# EAGLE design rgb-led-cc-driver-mk-4.0 (EAGLE 6.5.0)
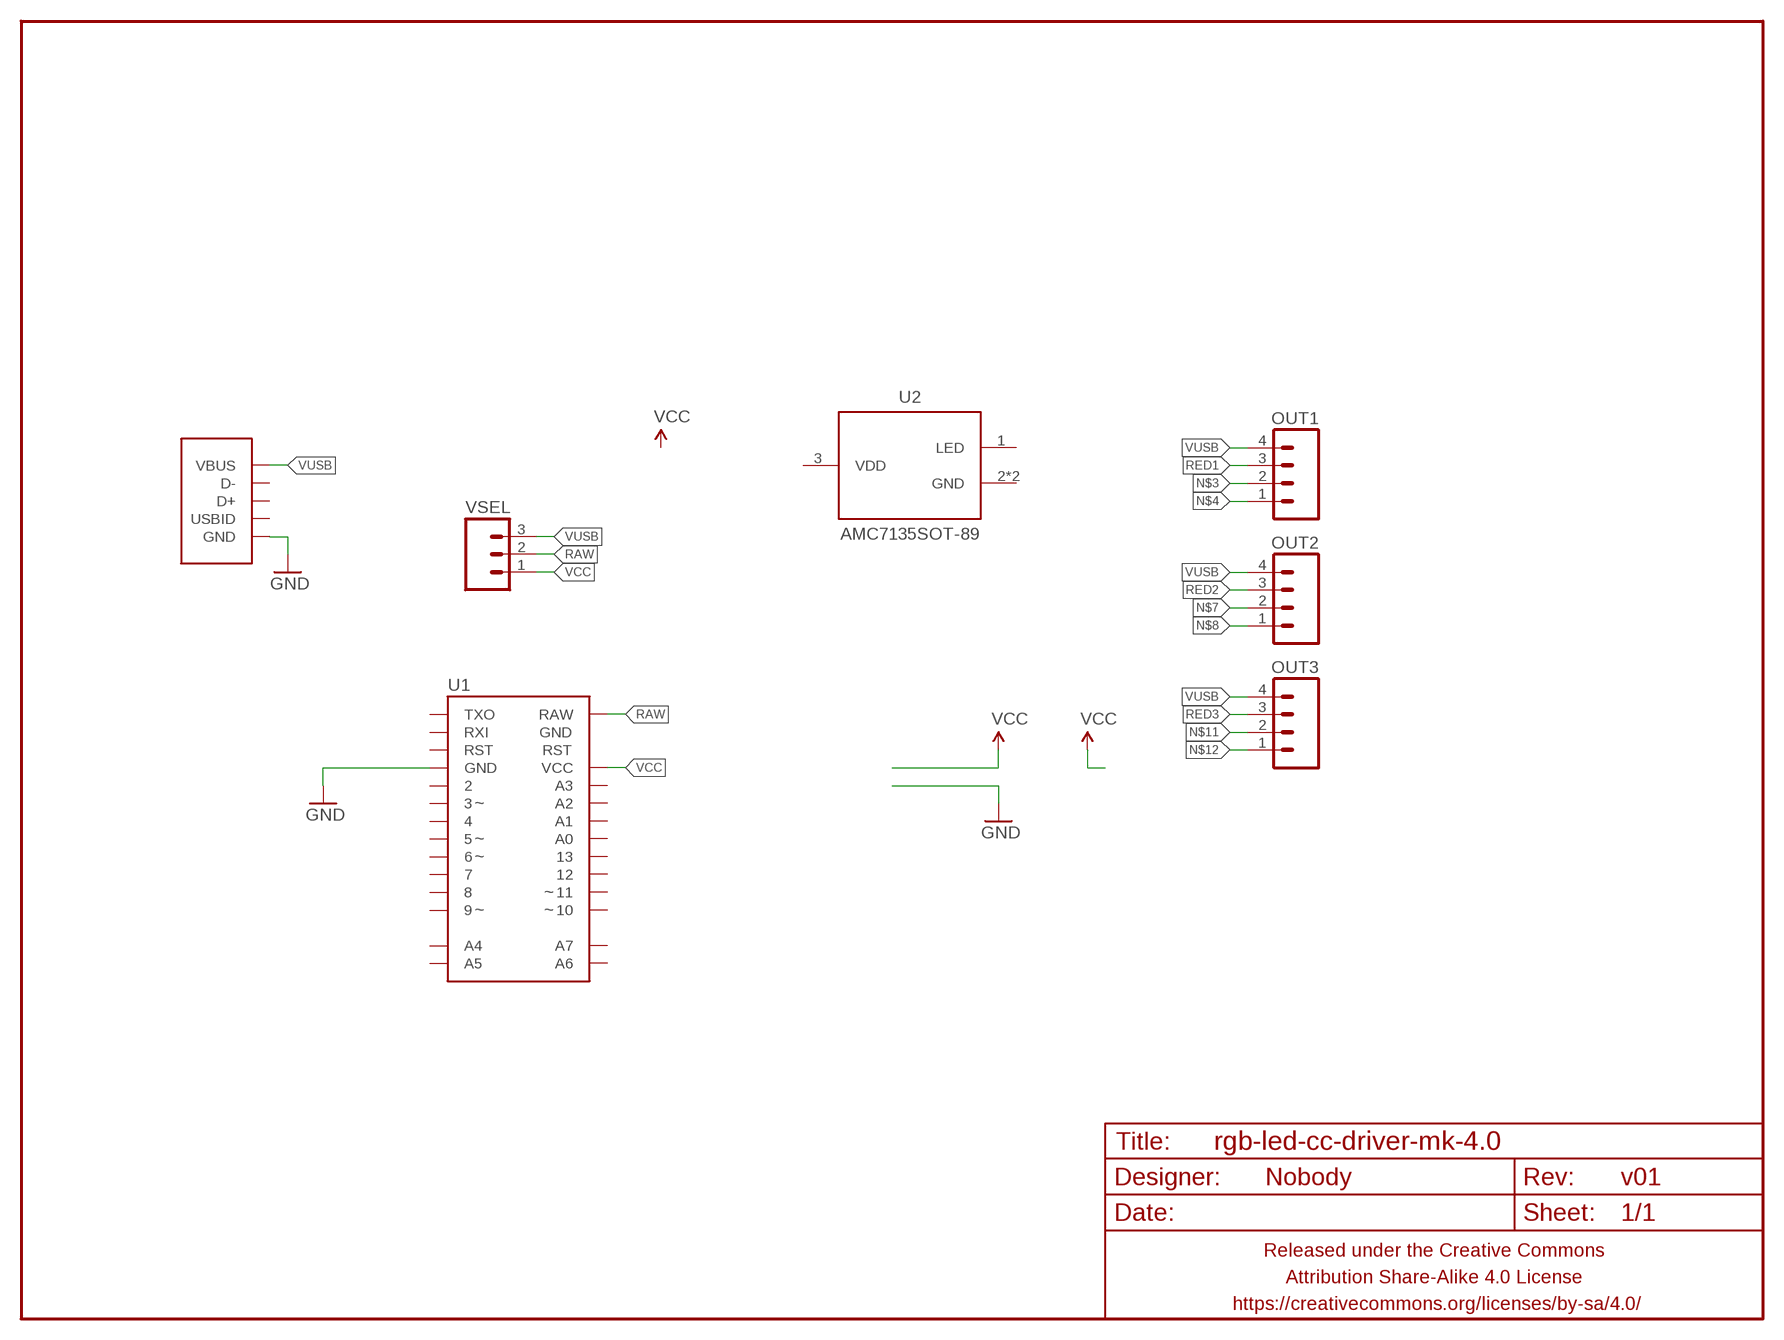
[diagram p0: schematic, sheet 1]

## Parts
FRAME1  FRAME-LETTERNO_PACKAGE  [DUMMY]
OUT1  M04JST-PTH  [JST-4-PH-RA-PTH]
OUT2  M04JST-PTH  [JST-4-PH-RA-PTH]
OUT3  M04JST-PTH  [JST-4-PH-RA-PTH]
PWR  USB-ABCOMBO-PWR  [USB-MICRO-B-FCI-CUTOUT2]
U1  ARDUINO-PRO-MINI-NO-FTDIARDUINO-PRO-MINI-NO-FTDI  [ARDUINO_PRO_MINI_NO_FTDI]
U2  AMC7135SOT-89  [SOT89]
VSEL  M03PTH  [1X03]

## Nets
GND: PWR.5(GND) PWR.P$1(GND) PWR.P$2(GND) U1.GND@1(GND) U1.GND@2(GND)
N$3: OUT1.2
N$4: OUT1.1
N$7: OUT2.2
N$8: OUT2.1
N$11: OUT3.2
N$12: OUT3.1
RAW: U1.RAW VSEL.2
RED1: OUT1.3
RED2: OUT2.3
RED3: OUT3.3
VCC: U1.VCC VSEL.1
VUSB: OUT1.4 OUT2.4 OUT3.4 PWR.1(VBUS) VSEL.3
Unconnected: PWR.2(D-) PWR.3(D+) PWR.4(USBID) U1.2 U1.3 U1.4 U1.5 U1.6 U1.7 U1.8 U1.9 U1.10 U1.11 U1.12 U1.13 U1.A0 U1.A1 U1.A2 U1.A3 U1.A4 U1.A5 U1.A6 U1.A7 U1.RST@1(RST) U1.RST@2(RST) U1.RX(RXI) U1.TX(TXO) U2.1(LED) U2.2(GND) U2.3(VDD) U2.4(GND)

## Library data of the parts
FRAME1 = A_butts:FRAME-LETTER: Schematic Frame Standard 8.5x11 US Letter frame; DESIGNER: Nobody; VERSION: v01
OUT1-OUT3 = A_butts:M04: Header 4 Standard 4-pin 0.1" header. Use with straight break away headers (SKU : PRT-00116), right angle break away headers (PRT-00553), swiss pins (PRT-00743), machine pins (PRT-00117), and female headers (PRT-00115). Molex polarized connector foot print use with SKU : PRT-08231 with associated crimp pins and housings. 1MM SMD Version SKU: PRT-10208; SKU: PRT-09916
PWR = A_butts:USB-AB: This is a USB AB connector that is compatible with USB OTG. i.e. this connector can serve as a host or device
U1 = A_butts:ARDUINO-PRO-MINI-NO-FTDI
U2 = A_butts:AMC7135
VSEL = A_butts:M03: Header 3 Standard 3-pin 0.1" header. Use with straight break away headers (SKU : PRT-00116), right angle break away headers (PRT-00553), swiss pins (PRT-00743), machine pins (PRT-00117), and female headers (PRT-00115). Molex polarized connector foot print use with SKU : PRT-08232 with associated crimp pins and housings.

## Board
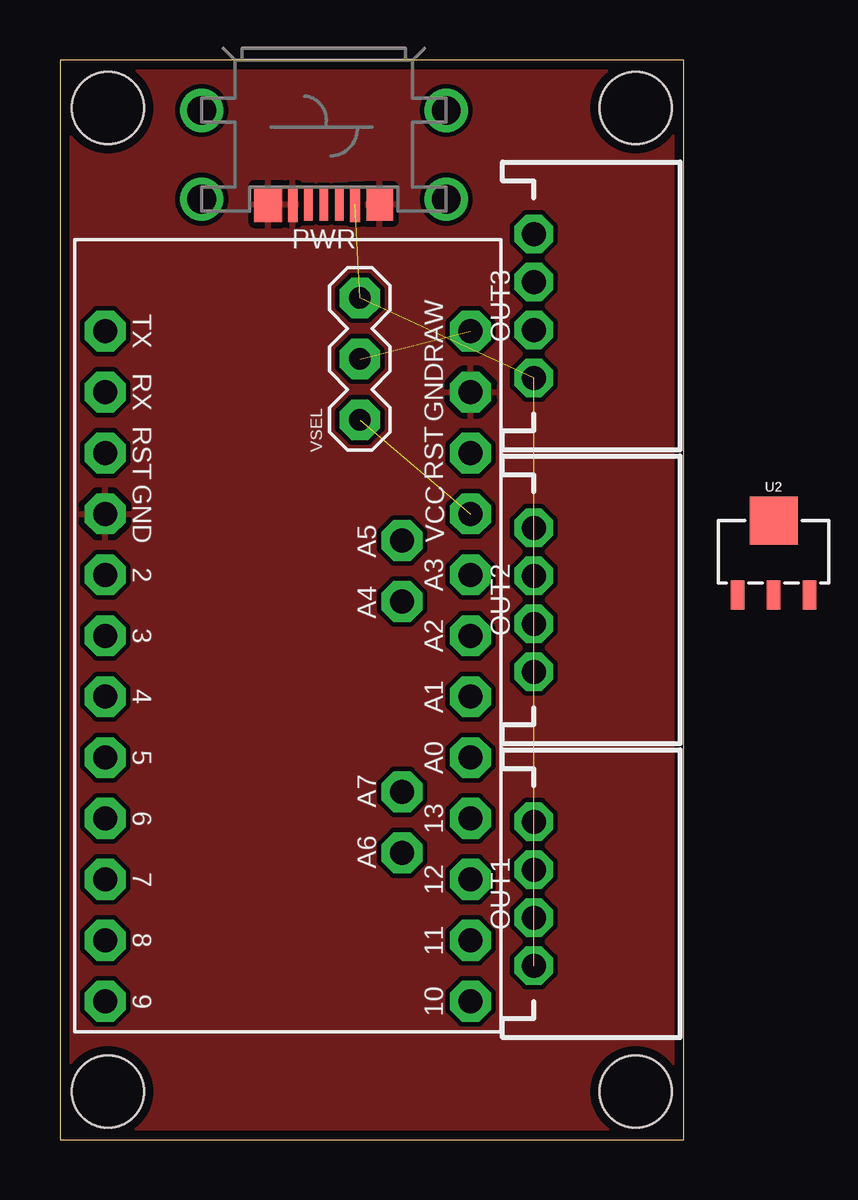
[diagram p1: board, top side]
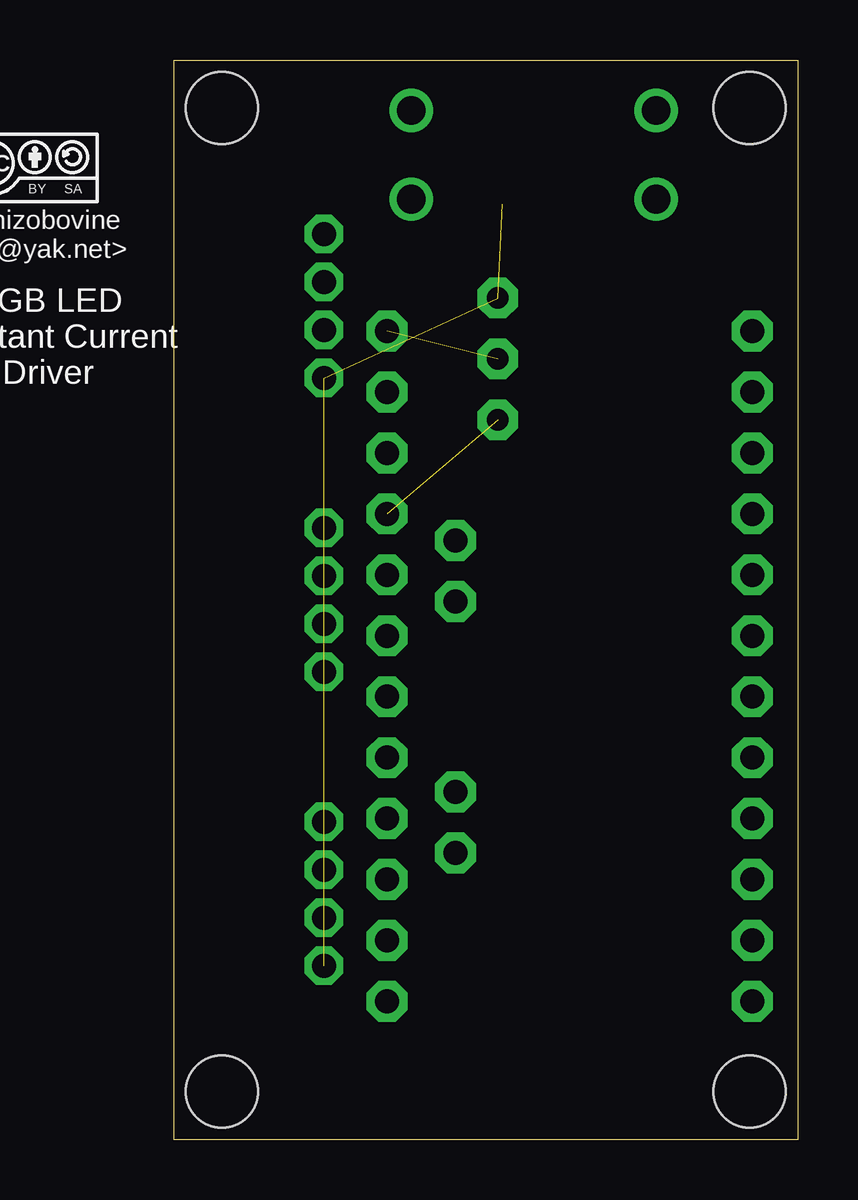
[diagram p2: board, bottom side, seen from below]

Size 26 x 45 mm. Coordinates in mm from the lower left corner, seen from the top.
Outline: 0,45 0,0 26,0 26,45 0,45
Copper layers (1*16): Top 0.0356mm / dielectric 1.5011mm / Bottom 0.0356mm
Design rules "LaenPCBOrder2": minimum track width 6mil, minimum drill 13mil, track to track 6mil, track to pad 6mil, pad to pad 6mil, via to via 6mil, smd to smd 6mil, copper to edge 15mil, drill to drill 6mil, minimum pad ring 7mil, minimum via ring 7mil, stop-mask expansion 3mil, vias tented up to drill 20mil, thermal gap 10mil
Holes 3 mm at 2,2 24,2 2,43 24,43

### Footprints (pad centres in the part's own frame; a part is rotated, then mirrored left to right if it is on the bottom)
JST-4-PH-RA-PTH = drill 1 pad 1.6 octagon: 1 0,0; 2 2,0; 3 4,0; 4 6,0
USB-MICRO-B-FCI-CUTOUT2 = smd 0.4 x 1.5: 1 -1.3,0; 5 1.3,0 | smd 0.35 x 1.4: 2 -0.65,0; 3 0,0; 4 0.65,0 | smd 1.1 x 1.4: P$1 -2.325,0 | smd 1.15 x 1.5: P$2 2.325,0 | drill 1.2: P$3 -5.1,-0.2; P$4 5.1,-0.2; P$5 -5.1,-3.9; P$6 5.1,-3.9
ARDUINO_PRO_MINI_NO_FTDI = drill 1 pad 1.7 octagon: 2 -7.62,2.54; 3 -7.62,0; 4 -7.62,-2.54; 5 -7.62,-5.08; 6 -7.62,-7.62; 7 -7.62,-10.16; 8 -7.62,-12.7; 9 -7.62,-15.24; 10 7.62,-15.24; 11 7.62,-12.7; 12 7.62,-10.16; 13 7.62,-7.62; A0 7.62,-5.08; A1 7.62,-2.54; A2 7.62,0; A3 7.62,2.54; A4 4.763,1.429; A5 4.763,3.969; A6 4.763,-9.049; A7 4.763,-6.509; GND@1 -7.62,5.08; GND@2 7.62,10.16; RAW 7.62,12.7; RST@1 -7.62,7.62; RST@2 7.62,7.62; RX -7.62,10.16; TX -7.62,12.7; VCC 7.62,5.08
SOT89 = smd 0.58 x 1.2: 1 -1.5,-1.8; 2 0,-1.8; 3 1.5,-1.8 | smd 2 x 2: 4 0,1.3
1X03 = drill 0.9 pad 1.7 octagon: 1 0,0; 2 2.54,0; 3 5.08,0

### Placement (x,y rotation side)
FRAME1  0,0 0 top
OUT1  19.75,13.25 270 top
OUT2  19.75,25.5 270 top
OUT3  19.75,37.75 270 top
PWR  11,39 180 top
U1  9.5,21 0 top
U2  29.75,24.5 0 top
U$1  [CC-BY-SA-4.0-NO-URL]  32,40.5 0 bottom  (outside the outline)
U$2  [COW_SMALL]  39.75,38.25 0 bottom  (outside the outline)
U$3  [OSHWLOGO_BOT_0.2_A]  43.5,38.75 0 top  (outside the outline)
VSEL  12.5,30 90 top

### Tracks (layer width: path | path; a pad name or v marks a point on that pad's centre or on a via)
GND
  pour Top (isolate 0.2): 26,0 0,0 0,45 26,45
RAW  (1 unrouted)
VCC  (1 unrouted)
VUSB  (4 unrouted)

### Text on the board
bPlace: by schizobovine / <sean@yak.net> | RGB LED / Constant Current / Driver